# EAGLE design pcb-txcm (EAGLE 9.6.2)
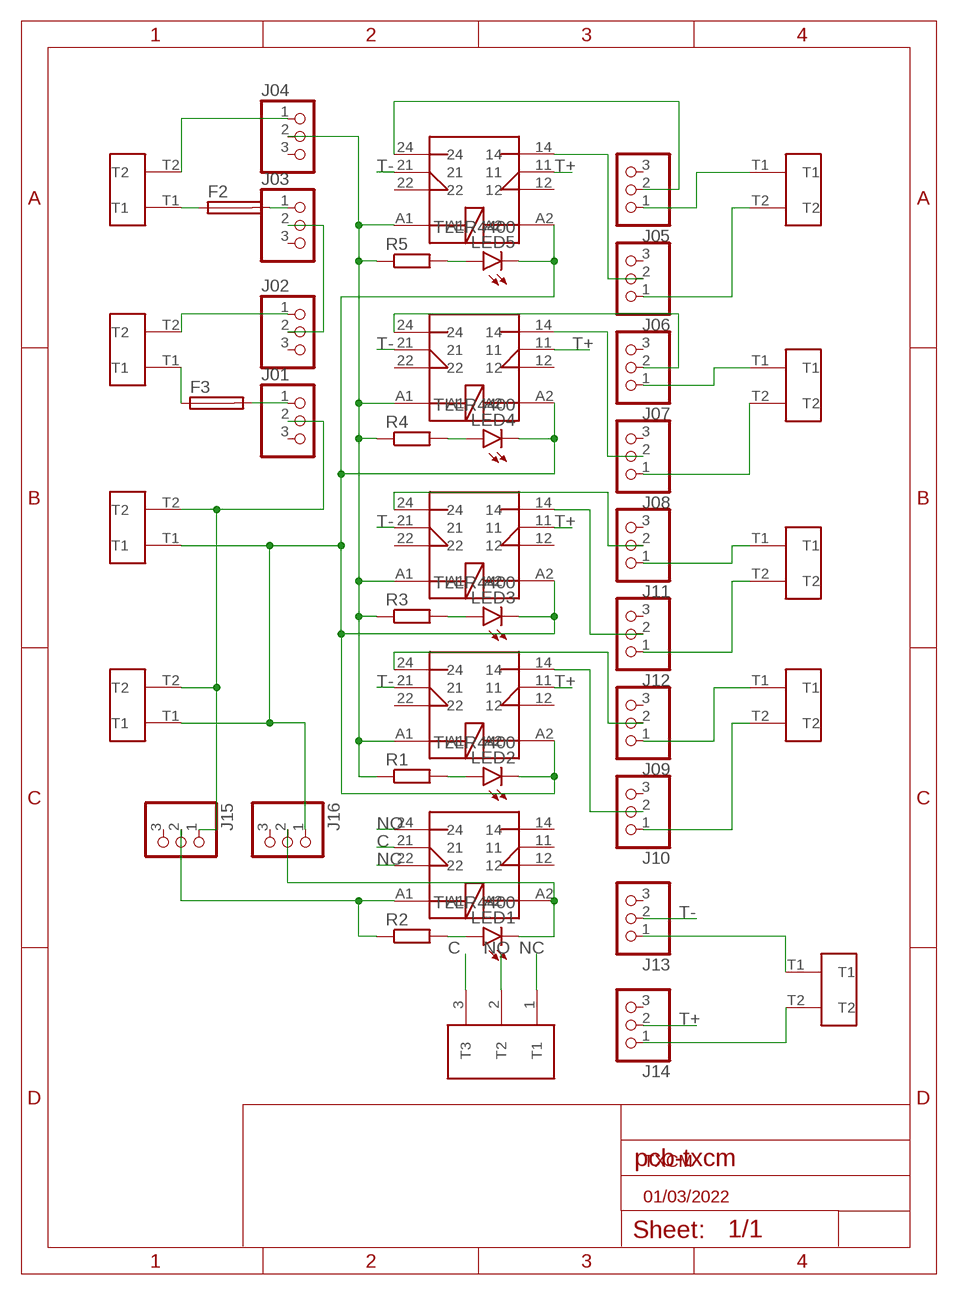
[diagram p0: schematic, sheet 1]

## Parts
F2  SH22,5A  [SH22,5A]
F3  SH22,5A  [SH22,5A]
J01  PINHD-1X3  [1X03]
J02  PINHD-1X3  [1X03]
J03  PINHD-1X3  [1X03]
J04  PINHD-1X3  [1X03]
J05  PINHD-1X3  [1X03]
J06  PINHD-1X3  [1X03]
J07  PINHD-1X3  [1X03]
J08  PINHD-1X3  [1X03]
J09  PINHD-1X3  [1X03]
J10  PINHD-1X3  [1X03]
J11  PINHD-1X3  [1X03]
J12  PINHD-1X3  [1X03]
J13  PINHD-1X3  [1X03]
J14  PINHD-1X3  [1X03]
J15  PINHD-1X3  [1X03]
J16  PINHD-1X3  [1X03]
LED1  TLLR4400  [LED3MM]
LED2  TLLR4400  [LED3MM]
LED3  TLLR4400  [LED3MM]
LED4  TLLR4400  [LED3MM]
LED5  TLLR4400  [LED3MM]
R1  R-EU_0309/12  [0309/12]
R2  R-EU_0309/12  [0309/12]
R3  R-EU_0309/12  [0309/12]
R4  R-EU_0309/12  [0309/12]
R5  R-EU_0309/12  [0309/12]
RSB2A080ED1  RSB2A080ED  [RSB2A080ED]
RSB2A080ED2  RSB2A080ED  [RSB2A080ED]
RSB2A080ED3  RSB2A080ED  [RSB2A080ED]
RSB2A080ED4  RSB2A080ED  [RSB2A080ED]
RSB2A080ED5  RSB2A080ED  [RSB2A080ED]
TB7.1  TB7.62  [TB7.62]
TB7.2  TB7.62  [TB7.62]
TB7.3  TB7.62  [TB7.62]
TB7.4  TB7.62  [TB7.62]
TB7.6  TB7.62  [TB7.62]
TB7.7  TB7.62  [TB7.62]
TB7.8  TB7.62  [TB7.62]
TB7.9  TB7.62  [TB7.62]
TB7.10  TB7.62  [TB7.62]
TB7.62-3P1  TB7.62-3P  [TB7.62-3P]

## Nets
48V+: J16.1 LED2.K(C) LED3.K(C) LED4.K(C) LED5.K(C) RSB2A080ED1.A2 RSB2A080ED2.A2 RSB2A080ED3.A2 RSB2A080ED4.A2 TB7.3.T1 TB7.4.T1
48V-: J01.2 J15.1 TB7.3.T2 TB7.4.T2
C: RSB2A080ED5.21 TB7.62-3P1.3(T3)
N$1: J04.1 TB7.1.T2
N$2: F2.1 TB7.1.T1
N$3: J04.2 R1.1 R3.1 R4.1 R5.1 RSB2A080ED1.A1 RSB2A080ED2.A1 RSB2A080ED3.A1 RSB2A080ED4.A1
N$4: J02.2 J03.2
N$5: J02.1 TB7.2.T2
N$6: F3.2 J01.1
N$7: F3.1 TB7.2.T1
N$8: F2.2 J03.1
N$9: J15.2 R2.1 RSB2A080ED5.A1
N$10: J16.2 LED1.K(C) RSB2A080ED5.A2
N$11: J05.2 RSB2A080ED1.24
N$12: J06.2 RSB2A080ED1.14
N$13: J05.1 TB7.6.T1
N$14: J06.1 TB7.6.T2
N$15: J07.2 RSB2A080ED2.24
N$16: J07.1 TB7.7.T1
N$17: LED1.A R2.2
N$18: J08.1 TB7.7.T2
N$19: J11.2 RSB2A080ED3.24
N$20: J11.1 TB7.8.T1
N$21: J12.2 RSB2A080ED3.14
N$22: J12.1 TB7.8.T2
N$23: J09.2 RSB2A080ED4.24
N$24: J09.1 TB7.9.T1
N$25: J10.2 RSB2A080ED4.14
N$26: J10.1 TB7.9.T2
N$27: LED2.A R1.2
N$28: LED3.A R3.2
N$29: J13.1 TB7.10.T1
N$30: J14.1 TB7.10.T2
N$31: LED4.A R4.2
N$32: LED5.A R5.2
N$34: J08.2 RSB2A080ED2.14
NC: RSB2A080ED5.22 TB7.62-3P1.1(T1)
NO: RSB2A080ED5.24 TB7.62-3P1.2(T2)
T+: J14.2 RSB2A080ED1.11 RSB2A080ED2.11 RSB2A080ED3.11 RSB2A080ED4.11
T-: J13.2 RSB2A080ED1.21 RSB2A080ED2.21 RSB2A080ED3.21 RSB2A080ED4.21
Unconnected: J01.3 J02.3 J03.3 J04.3 J05.3 J06.3 J07.3 J08.3 J09.3 J10.3 J11.3 J12.3 J13.3 J14.3 J15.3 J16.3 RSB2A080ED1.12 RSB2A080ED1.22 RSB2A080ED2.12 RSB2A080ED2.22 RSB2A080ED3.12 RSB2A080ED3.22 RSB2A080ED4.12 RSB2A080ED4.22 RSB2A080ED5.11 RSB2A080ED5.12 RSB2A080ED5.14

## Notes on the sheet
- TXCM
- 01/03/2022

## Library data of the parts
F2 F3 = fuse:SH22,5A: FUSE HOLDER grid 22,5mm, isolated cap OGN0031 8201, Schurter (Buerklin); MPN: 0031.7701.11; OC_FARNELL: unknown; OC_NEWARK: 04F1224
J01-J09 J10-J16 = pinhead:PINHD-1X3: PIN HEADER
LED1-LED5 = led:TLLR4400: Low Current (2mA) LED 3 mm Tinted Diffused Package color RED Source: Data sheet <http://www.farnell.com/datasheets/391100.pdf>; MF: VISHAY SEMICONDUCTOR; OC_FARNELL: 1612437
R1-R5 = rcl:R-EU_: RESISTOR, European symbol; SPICEPREFIX: R
RSB2A080ED1-RSB2A080ED5 = RSB2A080ED:RSB2A080ED
TB7.1-TB7.4 TB7.6-TB7.10 = TB7.62:TB7.62
TB7.62-3P1 = TB7.62-3P:TB7.62-3P

## Board
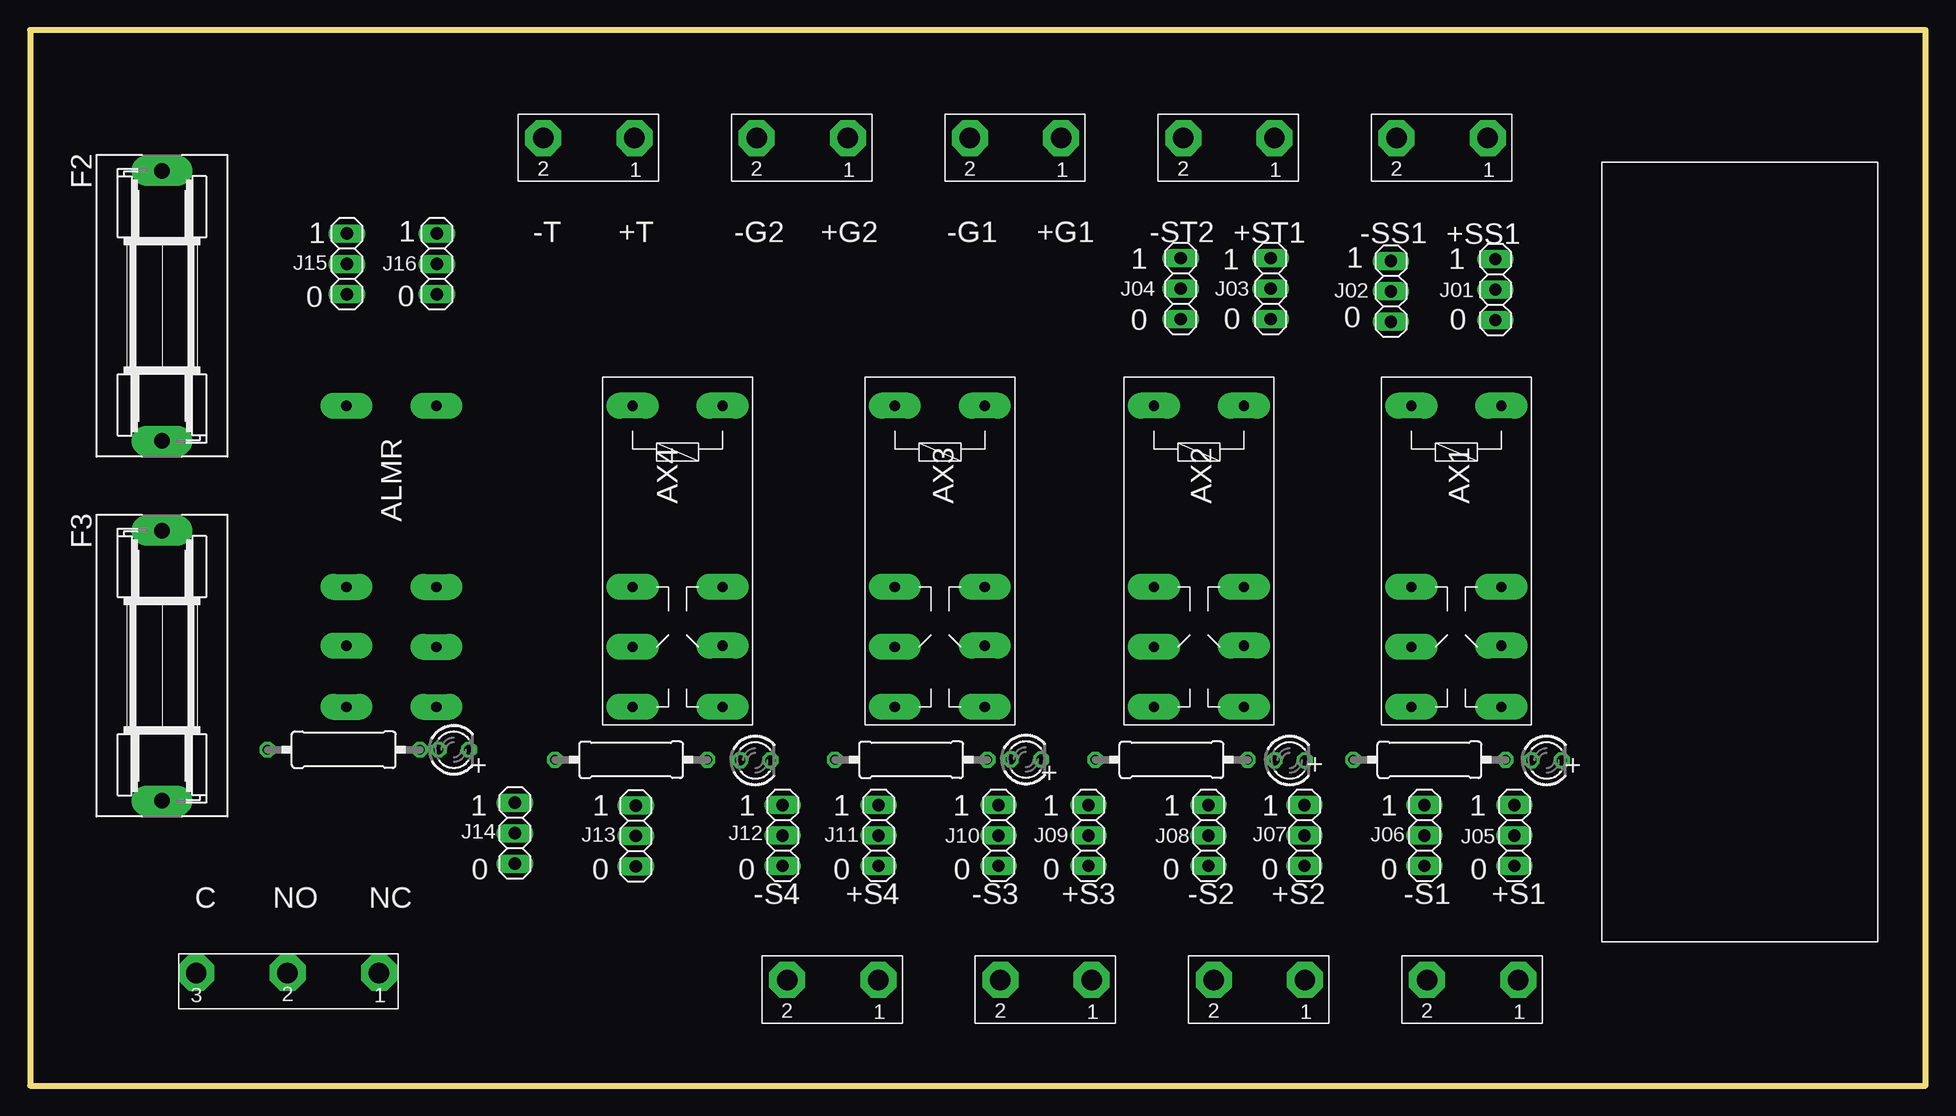
[diagram p1: board, top side]
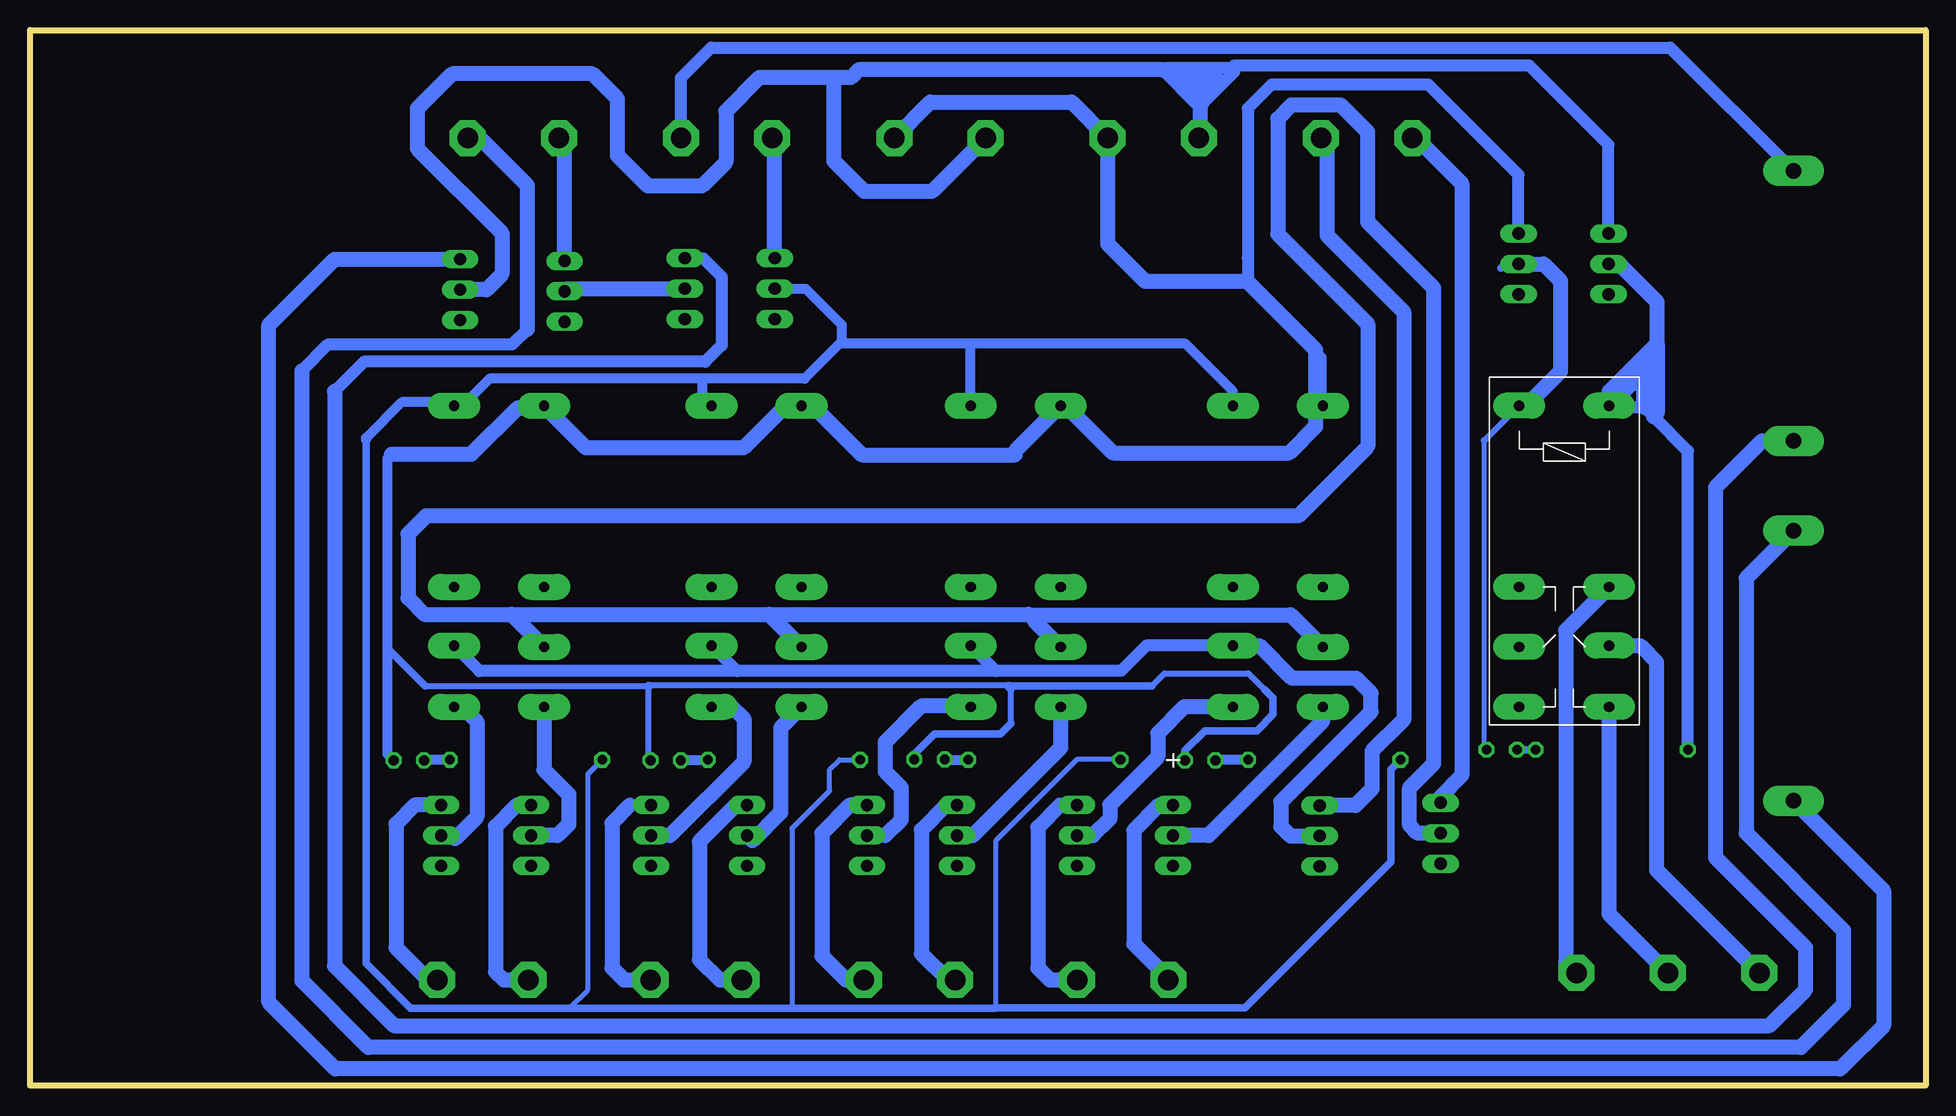
[diagram p2: board, bottom side, seen from below]

Size 158 x 88 mm. Coordinates in mm from the lower left corner, seen from the top.
Outline: 0,0 158,0 158,88 0,88 0,0
Copper layers (1*16): Top 0.035mm / dielectric 1.5mm / Bottom 0.035mm
Design rules "default": minimum track width 6mil, minimum drill 0.35mm, track to track 6mil, track to pad 6mil, pad to pad 6mil, via to via 6mil, smd to smd 6mil, copper to edge 40mil, drill to drill 6mil, minimum pad ring 10mil, minimum via ring 8mil, stop-mask expansion 4mil, vias tented up to drill 0mil, thermal gap 10mil

### Footprints (pad centres in the part's own frame; a part is rotated, then mirrored left to right if it is on the bottom)
SH22,5A = drill 1.321 pad 2.54 long: 1 -11.252,0; 2 11.252,0
1X03 = drill 1.016 long: 1 -2.54,0; 2 0,0; 3 2.54,0
LED3MM = drill 0.813 octagon: A -1.27,0; K 1.27,0
0309/12 = drill 0.813 octagon: 1 -6.35,0; 2 6.35,0
RSB2A080ED = drill 0.85 pad 2.184 long: 11 10,22.5; 12 10,17.5; 14 10,27.5; 21 2.5,22.4; 22 2.5,17.5; 24 2.5,27.5; A1 2.5,2.4; A2 10,2.4
TB7.62 = drill 1.7 pad 3 octagon: T1 -3.7,-0.6; T2 3.9,-0.6
TB7.62-3P = drill 1.7 pad 3 octagon: 1 -7.61,1; 2 0.01,1; 3 7.63,1

### Placement (x,y rotation side)
F2  11,65 270 top
F3  11,35 270 top
J01  122.15,66.35 270 top
J02  113.44,66.21 270 top
J03  103.42,66.43 270 top
J04  95.92,66.43 270 top
J05  123.73,20.84 270 top
J06  116.23,20.84 270 top
J07  106.23,20.84 270 top
J08  98.23,20.84 270 top
J09  88.23,20.84 270 top
J10  80.73,20.84 270 top
J11  70.73,20.84 270 top
J12  62.73,20.84 270 top
J13  50.5,20.8 270 top
J14  40.41,21.04 270 top
J15  26.42,68.5 270 top
J16  33.92,68.5 270 top
LED1  35.32,28 0 top
LED2  126.42,27.11 0 top
LED3  105.01,27.11 0 top
LED4  83.02,27.19 0 top
LED5  60.46,27.11 0 top
R1  116.65,27.16 0 top
R2  26.15,28 0 top
R3  95.15,27.16 0 top
R4  73.45,27.16 0 top
R5  50.11,27.16 0 top
RSB2A080ED1  125.15,59.07 180 top
RSB2A080ED2  103.68,59.07 180 top
RSB2A080ED3  60.23,59.07 180 top
RSB2A080ED4  82.09,59.07 180 top
RSB2A080ED5  23.87,59.07 180 bottom
TB7.1  100.03,78.4 180 top
TB7.2  117.81,78.4 180 top
TB7.3  82.25,78.4 180 top
TB7.4  64.47,78.4 180 top
TB7.6  120.35,8.2 180 top
TB7.7  102.57,8.2 180 top
TB7.8  67.01,8.2 180 top
TB7.9  84.79,8.2 180 top
TB7.10  46.69,78.4 180 top
TB7.62-3P1  21.48,10.39 180 top

### Tracks (layer width: path | path; a pad name or v marks a point on that pad's centre or on a via)
48V+
  Bottom 0.406: LED4.K 84.29,27.63
  Bottom 0.508: 76.44,33.35 106.44,33.35 | 76.21,30.18 76.21,33.01 | 64.46,33.33 63.43,34.36 56.45,34.36 55.1,33.01 | 125.08,33.32 106.44,33.32 | 106.44,27.27 106.44,33.18
  Bottom 0.61: J16.1 33.96,71 | 76.21,30.18 77.09,29.3 82.62,29.3 84.29,27.63 | 128.07,36.31 128.19,36.31 | 56.5,69 56.5,67 | 50.85,61.09 50.85,61.35 50.23,60.73 RSB2A080ED3.A2 | 72.09,56.59 72,56.5 | 71.5,56.5 72.09,57.09 72.5,56.68 72.5,56.5 | 128.19,37 128.09,36.91 128.09,36.34 128.07,36.31 | 125.08,33.32 128.07,36.31 | 106.44,33.18 106.44,33.32 106.44,33.35 | LED3.K 106.44,27.27 | 64.46,33.33 76.53,33.33 76.42,33.22 | 76.44,33.35 76.42,33.33 76.42,33.22 | 55.1,33.01 54.39,32.3 54.39,30.94 55.75,29.58 60.07,29.58 61.73,27.92 LED5.K | 76.21,33.01 76.42,33.22
  Bottom 0.813: 94.68,56.5 94,56.5 92.78,56.5 | 72,56.5 71.5,56.5 | 127.87,52.63 128.19,52.31 128.19,37 128.19,27.61 LED2.K
  Bottom 1.016: J16.1 33.92,75.92 41.45,83.45 54.51,83.45 56.5,81.46 56.5,69 56.5,67.05
  Bottom 1.27: 50.85,56.05 RSB2A080ED3.A2 50.85,57.29 | 92.78,56.5 93.51,56.5 RSB2A080ED2.A2 | 50.85,61.09 50.85,60.09 50.85,57.29 | 56.5,67 50.85,61.35 | 94,56.5 92.78,56.5 | 127.87,52.63 125.44,52.63 121.21,52.63 117.34,56.5 116.5,56.5 115.32,56.5 RSB2A080ED1.A2 | 72.09,57.09 RSB2A080ED4.A2 | RSB2A080ED4.A2 72.09,56.59 | TB7.3.T1 82.96,81.99 71.16,81.99 TB7.4.T1 68.17,70.17 65.05,67.05 56.5,67.05 | 50.85,57.29 50.85,54.92 53.04,52.73 67.73,52.73 71.5,56.5 | 94.68,56.5 95.17,56.5 98.52,53.15 111.65,53.15 115.15,56.65 RSB2A080ED1.A2 | 92.78,56.5 92.68,56.5 92.58,56.5 88.65,52.57 75.88,52.57 75.88,52.88 RSB2A080ED4.A2 | 72.5,56.5 72,56.5 | 115.66,56.54 115.28,56.54 RSB2A080ED1.A2
48V-
  Bottom 0.813: J15.1 26.5,71.12 | 60.57,82.93 60.5,83 60.5,83.02 60.5,83.5
  Bottom 1.016: J15.1 26.42,78.42 33.04,85.04 57.62,85.04 57.62,84.8 | 57.62,84.8 59.1,84.8 | 59.1,84.8 60.48,84.8 | 60.48,84.8 63.49,84.8 63.62,84.67 60.69,81.74 60.39,81.74 59.27,82.86 | 60.5,83 60.48,83.02 60.48,84.8 | 59.27,82.86 57.62,84.51 57.62,84.8 | 60.5,81.74 62.02,83.26 62.02,84.17 61.38,83.53 61.38,83.13 61.15,83.36 61.15,84.17 60.07,84.17 59.27,83.36 59.27,82.86 | 59.12,84.17 59.1,84.19 59.1,84.8
  Bottom 1.27: 60.5,83 60.5,81.74 | 60.5,81.74 60.5,79.07 TB7.4.T2 | 60.39,81.74 60.5,81.74 | 60.35,83.02 60.5,83.02 | 63.17,84.67 63.62,84.67 88.94,84.67 89.58,84.03 90.93,84.03 | 90.93,84.03 97.22,84.03 100,81.25 100,77 102,75 106.5,75 109.04,77.54 109.04,82.27 111.12,84.35 122.8,84.35 125.71,81.44 125.71,78.11 118.65,71.05 118.65,67.65 119.95,66.35 J01.2 | 90.93,84.03 91,83.96 91,77.08 88.44,74.53 82.83,74.53 TB7.3.T2
C
  Bottom 1.27: TB7.62-3P1.3 22.42,17.96 22.42,35.3 23.79,36.67 RSB2A080ED5.21
N$1
  Bottom 1.27: J04.1 95.97,69.02 95.97,78.84 TB7.1.T2
N$2
  Bottom 1.016: TB7.1.T1 103.73,84.02 101.22,86.53 21.28,86.53 F2.1
N$3
  Bottom 0.406: 113.08,6.42 113.07,6.43 111.5,8 111.5,25.96 R1.1 | 122.95,56.97 RSB2A080ED1.A1 | R3.1 90.53,27.16 91.34,26.35 91.34,24.58 94.5,21.42 94.5,6.44 94.5,6.42 | R4.1 70.73,27.17 77.52,20.38 77.52,6.46 77.52,6.44
  Bottom 0.61: 77.52,6.46 56.72,6.46 44.55,18.63 44.55,26.37 R5.1 | 94.5,6.42 113.08,6.42 | 130,53.83 130,10.17 126.26,6.43 113.07,6.43 | J04.2 96.84,66.43 | 77.52,6.44 94.5,6.44
  Bottom 0.813: 122.95,56.97 127.02,56.97 130,53.99 130,53.83 | RSB2A080ED1.A1 121.94,56.67 119.69,58.92 102.13,58.92 101.93,58.92 | J04.2 93.34,66.43 90.34,63.43 90.34,62.01 90.51,61.84 | RSB2A080ED3.A1 57.73,57.88 61.69,61.84 79.77,61.84 | 90.51,61.84 93.43,58.92 101.93,58.92 | 79.77,61.84 90.51,61.84 | RSB2A080ED4.A1 79.59,61.66 79.77,61.84 | RSB2A080ED2.A1 101.93,57.42 101.93,58.92
N$4
  Bottom 1.27: J03.2 103.44,66.41 113.24,66.41 J02.2
N$5
  Bottom 1.27: J02.1 113.5,68.81 113.5,78.59 TB7.2.T2
N$6
  Bottom 1.27: F3.2 3.5,16.25 3.5,5 7.11,1.39 132.55,1.39 138.1,6.94 138.1,63.4 132.61,68.89 J01.1
N$7
  Bottom 1.016: 116.54,63.06 117.8,61.8 133.14,61.8 135.33,59.6
  Bottom 1.27: F3.1 14.95,42.31 14.95,21.05 6.84,12.95 6.84,6.73 10.39,3.18 129.8,3.18 135.33,8.71 135.33,59.6 | 116.54,63.06 116.54,75.04 120.5,79 TB7.2.T1
N$8
  Bottom 1.016: J03.1 101.88,68.97 100.34,67.43 100.34,61.72 101.71,60.35 130.15,60.35 132.62,57.88
  Bottom 1.27: 132.62,57.88 132.62,9.96 127.65,4.99 13.01,4.99 10,8 10,11.5 17.5,19 17.5,49.89 13.64,53.75 F2.2
N$9
  Bottom 1.016: R2.1 19.8,52.9 22.66,55.76 23.44,56.54 26.24,56.54 RSB2A080ED5.A1 26.37,57.86
  Bottom 1.27: J15.2 25.53,68.5 22.36,65.33 22.36,61.88 | 26.37,57.86 23.52,60.7 | 23.52,60.7 22.36,61.88 | 22.36,61.88 22.36,56.05 22.66,55.76 | 23.52,60.7 23.52,58.55 | 23.52,58.55 23.52,56.62 23.44,56.54 | RSB2A080ED5.A1 24.49,58.55 23.52,58.55
N$10
  Bottom 0.406: 36.83,53.78 36.83,28.24 LED1.K
  Bottom 0.508: 36.83,53.78 36.76,53.78 RSB2A080ED5.A2
  Bottom 0.61: J16.2 35.01,68.5 35.38,68.13 | 33.17,56.67 RSB2A080ED5.A2
  Bottom 1.27: J16.2 31.83,68.5 30.42,67.09 30.42,59.54 33.29,56.67 RSB2A080ED5.A2
N$11
  Bottom 1.27: J05.2 122.84,20.84 122.57,20.57 120.74,22.4 120.74,30.34 121.97,31.57 RSB2A080ED1.24
N$12
  Bottom 1.27: RSB2A080ED1.14 115.15,26.33 113.1,24.28 113.1,21.77 114.03,20.84 J06.2
N$13
  Bottom 1.27: TB7.6.T1 124.8,8.8 127.5,11.5 127.5,21.82 125.94,23.38 J05.1
N$14
  Bottom 1.27: TB7.6.T2 118.49,8.8 119.19,9.5 119.19,21.62 117.43,23.38 J06.1
N$15
  Bottom 1.27: J07.2 104.66,20.84 98.5,27 98.5,30.59 99.48,31.57 RSB2A080ED2.24
N$16
  Bottom 0.813: J07.1 108.01,23.38
  Bottom 1.27: 108.01,23.38 109.5,21.89 109.5,9.81 108.49,8.8 TB7.7.T1
N$17
  Bottom 0.61: R2.2 LED1.A
N$18
  Bottom 1.27: TB7.7.T2 100.49,8.8 102.19,10.5 102.19,20.34 99.15,23.38 J08.1
N$19
  Bottom 1.27: RSB2A080ED3.24 61.8,31.57 64,29.37 64,27.41 68,23.41 68,22.22 69.38,20.84 J11.2
N$20
  Bottom 0.813: J11.1 72.15,23.38
  Bottom 1.27: 72.15,23.38 74,21.53 74,9.81 72.99,8.8 TB7.8.T1
N$21
  Bottom 1.27: J12.2 59.77,20.84 50.23,30.38 RSB2A080ED3.14
N$22
  Bottom 0.813: J12.1 63.89,23.38
  Bottom 1.27: 63.89,23.38 66,21.27 66,11.81 63.11,8.92 TB7.8.T2
N$23
  Bottom 1.27: RSB2A080ED4.24 79.66,31.64 83.71,31.64 86.7,28.65 86.7,26.15 85.37,24.82 85.37,22.16 86.69,20.84 J09.2
N$24
  Bottom 1.27: TB7.9.T1 89.99,8.8 92,10.81 92,21.03 89.65,23.38 J09.1
N$25
  Bottom 0.813: 79.41,20.84 J10.2
  Bottom 1.27: RSB2A080ED4.14 72.09,28.16 79.41,20.84
N$26
  Bottom 0.813: J10.1 81.63,23.38
  Bottom 1.27: 81.63,23.38 83.69,21.32 83.69,11 81.49,8.8 TB7.9.T2
N$27
  Bottom 0.813: R1.2 125.1,27.16 LED2.A
N$28
  Bottom 0.813: R3.2 103.69,27.16 LED3.A
N$29
  Bottom 0.813: TB7.10.T1 49.89,78.5
  Bottom 1.27: 49.89,78.5 49.89,70.89 43.5,64.5 43.5,30.51 46.13,27.88 46.13,24.73 47.52,23.34 J13.1
N$30
  Bottom 1.27: TB7.10.T2 42.45,79 38.65,75.2 38.65,25.84 40.41,24.08 J14.1
N$31
  Bottom 0.813: R4.2 81.72,27.16 LED4.A
N$32
  Bottom 0.813: R5.2 59.14,27.16 LED5.A
N$34
  Bottom 1.27: RSB2A080ED2.14 95.42,29.83 95.42,22.77 97.79,20.4 J08.2
NC
  Bottom 1.27: TB7.62-3P1.1 30,10.3 30,37.94 RSB2A080ED5.22
NO
  Bottom 1.27: TB7.62-3P1.2 26.37,14.29 RSB2A080ED5.24
T+
  Bottom 0.813: 74.8,39.28 74.76,39.24 74.35,38.83
  Bottom 1.27: J14.2 42.35,21.04 43.02,21.71 43.02,24.83 41,26.85 41,66.5 46.5,72 46.5,79.5 48.74,81.74 52.88,81.74 54,80.62 54,71 46.5,63.5 46.5,53.28 52.28,47.5 53.75,47.5 55.42,47.5 125,47.5 126.5,46 126.5,40.64 125.14,39.28 117.86,39.28 | 117.86,39.28 RSB2A080ED1.11 | 117.86,39.28 96.39,39.28 | 96.39,39.28 RSB2A080ED2.11 | 96.39,39.28 74.8,39.28 | 74.35,38.83 RSB2A080ED4.11 | 74.76,39.24 52.9,39.24 RSB2A080ED3.11
T-
  Bottom 1.016: 55.53,36.67 RSB2A080ED3.21 64.95,36.67 67.05,34.57 77.49,34.57 | 77.49,34.57 RSB2A080ED4.21 | 99.06,34.55 77.47,34.55 77.49,34.57 | 99.06,34.55 RSB2A080ED2.21 | 99.06,34.55 120.53,34.55 RSB2A080ED1.21
  Bottom 1.27: 55.53,36.67 52.8,33.94 47.44,33.94 46.22,32.72 46.22,31.16 53.73,23.65 53.73,21.6 52.93,20.8 J13.2

### Text on the board
tPlace: 1 | 1 | -T | +T | -G2 | +G2 | -G1 | +G1 | -ST2 | +ST1 | -SS1 | +SS1 | 1 | 1 | 1 | 1 | 0 | 0 | 0 | 0 | 0 | 0 | + | + | + | + | 1 | 1 | 1 | 1 | 1 | 1 | 1 | 1 | 1 | 1 | 0 | 0 | 0 | 0 | 0 | 0 | 0 | 0 | 0 | 0 | -S4 | +S4 | -S3 | +S3 | -S2 | +S2 | -S1 | +S1 | C | NO | NC
bPlace: +
tNames: AX4 | AX3 | AX2 | AX1 | ALMR